# EAGLE schematic power supply (EAGLE 8.4.0)
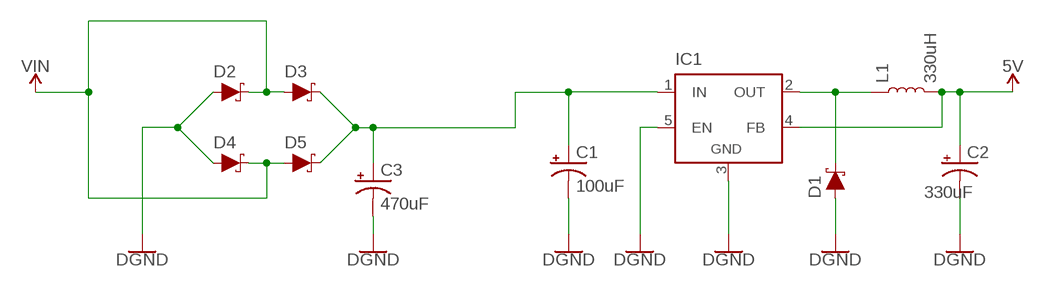
[diagram p0: schematic, sheet 1]

## Parts
C1  100uF  100UF-POLAR-RADIAL-2.5MM-25V-20%  [CPOL-RADIAL-2.5MM-6.5MM]
C2  47UF-POLAR-PANASONIC_D-50V-20%  [PANASONIC_D]
C3  470uF  47UF-POLAR-PANASONIC_D-35V-20%  [PANASONIC_D]
D1  DIODE-SCHOTTKY-B340A  [SMA-DIODE]
D2  DIODE-SCHOTTKY-B340A  [SMA-DIODE]
D3  DIODE-SCHOTTKY-B340A  [SMA-DIODE]
D4  DIODE-SCHOTTKY-B340A  [SMA-DIODE]
D5  DIODE-SCHOTTKY-B340A  [SMA-DIODE]
IC1  LM2596TH  [TO220-52]
L1  330uH  INDUCTOR-CR75-68UH  [CR75]

## Nets
5V: C2.+ IC1.4(FB) L1.P$2
GND: C2.- C3.- D1.A D2.A D4.A IC1.3(GND) IC1.5(EN) ; supply symbol labelled DGND
N$2: C1.2(-)
N$4: C1.1(+) C3.+ D3.C D5.C IC1.1(IN)
N$5: D1.C IC1.2(OUT) L1.P$1
VIN: D2.C D3.A D4.C D5.A

## Notes on the sheet
- 330uF

## Library data of the parts
C1 = SparkFun-Capacitors:100UF-POLAR: 100µF polarized capacitors A capacitor is a passive two-terminal electrical component used to store electrical energy temporarily in an electric field.; PROD_ID: CAP-08439
C2 = SparkFun-Capacitors:47UF-POLAR: 47µF polarized capacitors A capacitor is a passive two-terminal electrical component used to store electrical energy temporarily in an electric field.
C3 = SparkFun-Capacitors:47UF-POLAR: 47µF polarized capacitors A capacitor is a passive two-terminal electrical component used to store electrical energy temporarily in an electric field.; PROD_ID: CAP-08478; VALUE: 47uF
D1-D5 = SparkFun-DiscreteSemi:DIODE-SCHOTTKY: Schottky diode A Schottky diode is a semiconductor diode which has a low forward voltage drop and a very fast switching action.; PROD_ID: DIO-09886; VALUE: 3A/40V/500mV
IC1 = linear:LM2596T: STEP-DOWN VOLTAGE REGULATOR
L1 = SparkFun-Coils:INDUCTOR: Inductors Resist changes in electrical current. Basically a coil of wire. SparkFun Products: SparkFun Load Cell Amplifier - HX711 <https://www.sparkfun.com/products/13879> IOIO-OTG - V2.2 <https://www.sparkfun.com/products/13613>; PROD_ID: NDUC-09739; VALUE: 68µH/±20%/1.05A